# Altium schematic sheet 小车主板原理图3.SchDoc
size A3
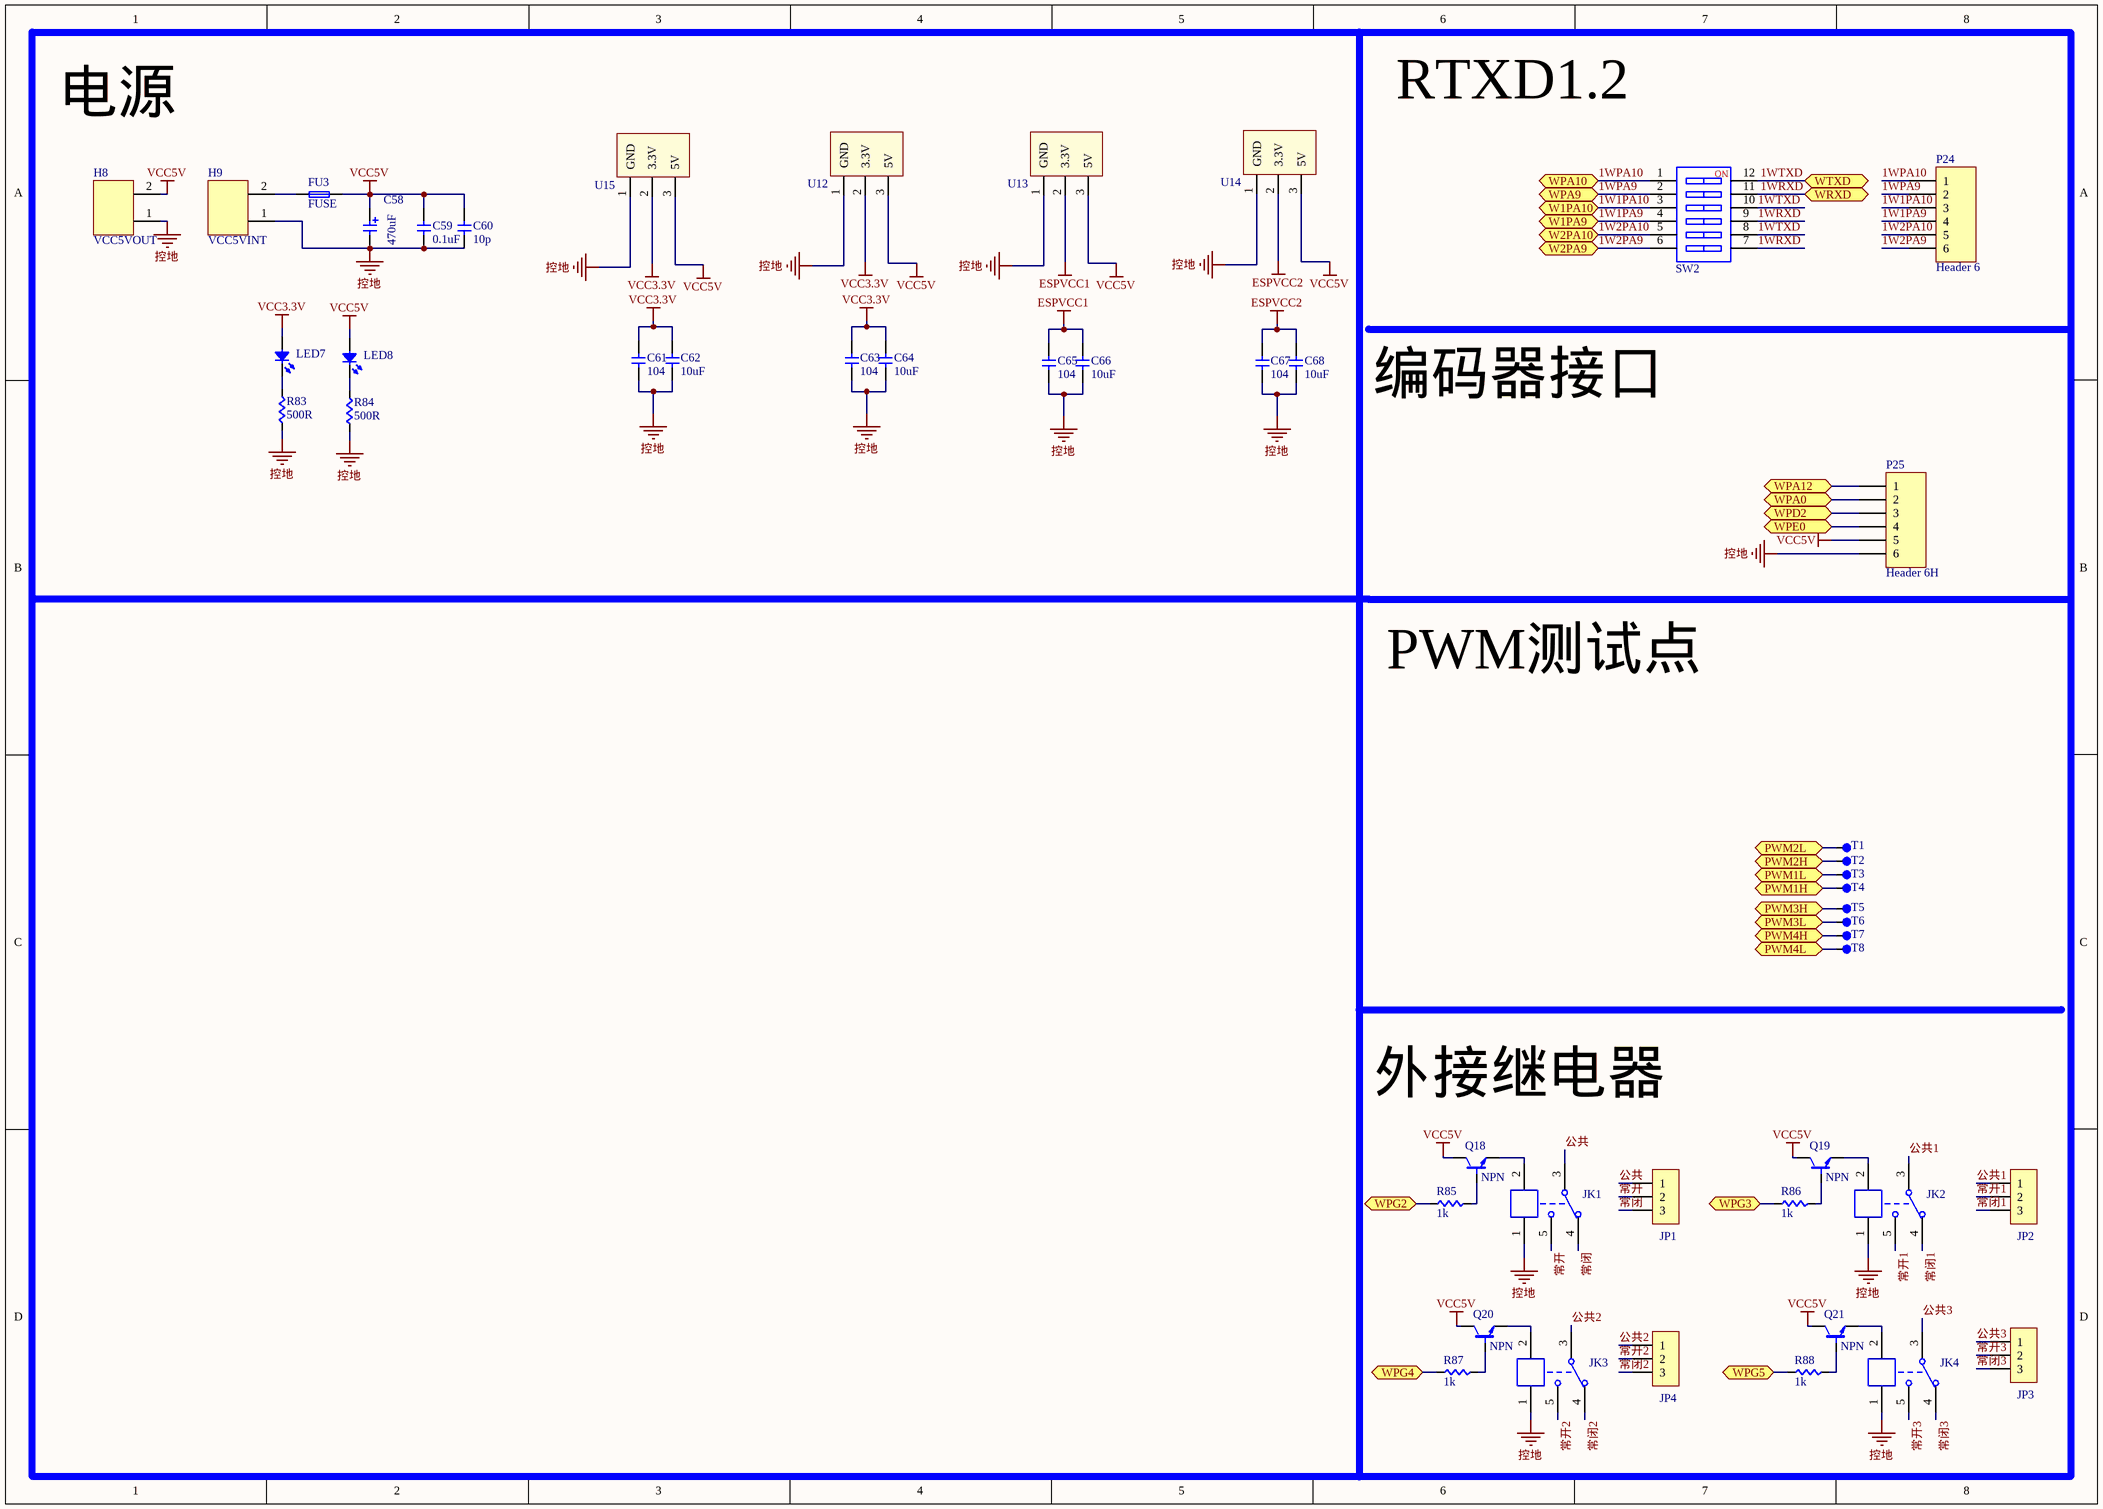
[diagram p0: 小车主板原理图3.SchDoc]

## Parts
C58  470uF  [CD-8*8-2]
C59  0.1uF  [0805C]
C60  10p  [0805C]
C61  104  [0805C]
C62  10uF  [0805C]
C63  104  [0805C]
C64  10uF  [0805C]
C65  104  [0805C]
C66  10uF  [0805C]
C67  104  [0805C]
C68  10uF  [0805C]
FU3  FUSE  [1206]
H8  VCC5VOUT  [KF301接线端子]
H9  VCC5VINT  [KF301接线端子]
JK1  (no value)  [SRD-C_B]
JK2  (no value)  [SRD-C_B]
JK3  (no value)  [SRD-C_B]
JK4  (no value)  [SRD-C_B]
JP1  HDR-1X3  [KF301-3P]  (value not drawn)
JP2  HDR-1X3  [KF301-3P]  (value not drawn)
JP3  HDR-1X3  [KF301-3P]  (value not drawn)
JP4  HDR-1X3  [KF301-3P]  (value not drawn)
LED7  LED  [0805D]  (value not drawn)
LED8  LED  [0805D]  (value not drawn)
P24  Header 6  [HDR1X6]
P25  Header 6H  [PZ_XH-2.54-6P]
Q18  NPN  [SOT-23]
Q19  NPN  [SOT-23]
Q20  NPN  [SOT-23]
Q21  NPN  [SOT-23]
R83  500R  [0805]
R84  500R  [0805]
R85  1k  [0805]
R86  1k  [0805]
R87  1k  [0805]
R88  1k  [0805]
SW2  CSW-6P  [CSW DIP-6P]  (value not drawn)
T1  1 测试点  [SIP1-1*1]  (value not drawn)
T2  1 测试点  [SIP1-1*1]  (value not drawn)
T3  1 测试点  [SIP1-1*1]  (value not drawn)
T4  1 测试点  [SIP1-1*1]  (value not drawn)
T5  1 测试点  [SIP1-1*1]  (value not drawn)
T6  1 测试点  [SIP1-1*1]  (value not drawn)
T7  1 测试点  [SIP1-1*1]  (value not drawn)
T8  1 测试点  [SIP1-1*1]  (value not drawn)
U12  LM1117  [SOT-223]  (value not drawn)
U13  LM1117  [SOT-223]  (value not drawn)
U14  LM1117  [SOT-223]  (value not drawn)
U15  LM1117  [SOT-223]  (value not drawn)

## Ports
PWM1H, PWM1L, PWM2H, PWM2L, PWM3H, PWM3L, PWM4H, PWM4L, W1PA9, W1PA10, W2PA9, W2PA10, WPA0, WPA9, WPA10, WPA12, WPD2, WPE0, WPG2, WPG3, WPG4, WPG5, WRXD, WTXD

## Nets
ESPVCC1: C65.2 C66.2 U13.2(3.3V)
ESPVCC2: C67.2 C68.2 U14.2(3.3V)
VCC3.3V: C61.2 C62.2 C63.2 C64.2 LED7.1(A) U12.2(3.3V) U15.2(3.3V)
VCC5V: C58.1 C59.2 C60.2 FU3.2 H8.2 LED8.1(A) P25.5 Q18.1(c) Q19.1(c) Q20.1(c) Q21.1(c) U12.3(5V) U13.3(5V) U14.3(5V) U15.3(5V)
控地: C58.2 C59.1 C60.1 C61.1 C62.1 C63.1 C64.1 C65.1 C66.1 C67.1 C68.1 H8.1 H9.1 JK1.1 JK2.1 JK3.1 JK4.1 P25.6 R83.1 R84.1 U12.1(GND) U13.1(GND) U14.1(GND) U15.1(GND)
1W1PA9: P24.4 SW2.4 ; port W1PA9
1W1PA10: P24.3 SW2.3 ; port W1PA10
1W2PA9: P24.6 SW2.6 ; port W2PA9
1W2PA10: P24.5 SW2.5 ; port W2PA10
1WPA9: P24.2 SW2.2 ; port WPA9
1WPA10: P24.1 SW2.1 ; port WPA10
1WRXD: SW2.7 SW2.9 SW2.11 ; port WRXD
1WTXD: SW2.8 SW2.10 SW2.12 ; port WTXD
PWM1H: T4.1 ; port PWM1H
PWM1L: T3.1 ; port PWM1L
PWM2H: T2.1 ; port PWM2H
PWM2L: T1.1 ; port PWM2L
PWM3H: T5.1 ; port PWM3H
PWM3L: T6.1 ; port PWM3L
PWM4H: T7.1 ; port PWM4H
PWM4L: T8.1 ; port PWM4L
WPA0: P25.2 ; port WPA0
WPA12: P25.1 ; port WPA12
WPD2: P25.3 ; port WPD2
WPE0: P25.4 ; port WPE0
WPG2: R85.1 ; port WPG2
WPG3: R86.1 ; port WPG3
WPG4: R87.1 ; port WPG4
WPG5: R88.1 ; port WPG5
公共: JK1.3 JP1.1
公共1: JK2.3 JP2.1
公共2: JK3.3 JP4.1
公共3: JK4.3 JP3.1
常开: JK1.5 JP1.2
常开1: JK2.5 JP2.2
常开2: JK3.5 JP4.2
常开3: JK4.5 JP3.2
常闭: JK1.4 JP1.3
常闭1: JK2.4 JP2.3
常闭2: JK3.4 JP4.3
常闭3: JK4.4 JP3.3
NetFU3_1: FU3.1 H9.2
NetJK1_2: JK1.2 Q18.2(e)
NetJK2_2: JK2.2 Q19.2(e)
NetJK3_2: JK3.2 Q20.2(e)
NetJK4_2: JK4.2 Q21.2(e)
NetLED7_2: LED7.2(K) R83.2
NetLED8_2: LED8.2(K) R84.2
NetQ18_3: Q18.3(b) R85.2
NetQ19_3: Q19.3(b) R86.2
NetQ20_3: Q20.3(b) R87.2
NetQ21_3: Q21.3(b) R88.2

## Notes on the sheet
- RTXD1.2
- 电源
- 编码器接口
- PWM测试点
- (near Q18) 外接继电器
- (in symbol CSW-6P) NO

## Library data of the parts
C58 = C+: Published: 8-Jun-2000; LatestRevisionDate: 17-Jul-2002; LatestRevisionNote: Re-released for DXP Platform.; PackageReference: RB7.6-15; Publisher: Altium Limited; PackageDescription: Polarized Capacitor (Radial); 2 Leads
C59-C68 = C
H8 H9 = KF301 接线端子
JK1-JK4 = SRD-05VDC-SL-C: 5V单路双控继电器; BOM名称: 5V继电器; 版权归属: 源创客; 学习资源: www.ooocke.com
JP1-JP4 = Header 3: 3P接插件; 版权归属: 源创客; BOM名称: 3P接插件; 学习资源: www.ooocke.com
P24 = Header 6: Header, 6-Pin; LatestRevisionDate: 17-Jul-2002; LatestRevisionNote: Re-released for DXP Platform.; Publisher: Altium Limited
P25 = Header 6H: Header, 6-Pin, Right Angle; LatestRevisionDate: 17-Jul-2002; LatestRevisionNote: Re-released for DXP Platform.; Publisher: Altium Limited
R83-R88 = Res
SW2 = CSW-6P: 6路编码开关; 版权归属: 源创客; BOM名称: 6路编码开关; 学习资源: www.ooocke.com
LED7 LED8 = LED: Published: 8-Jun-2000; LatestRevisionDate: 08-Jul-2005; LatestRevisionNote: Mech Layer 1 removed.; PackageReference: LED-0; Publisher: Altium Limited; PackageDescription: LED; 2 Leads